# EAGLE schematic ORing_block (EAGLE 8.1.0)
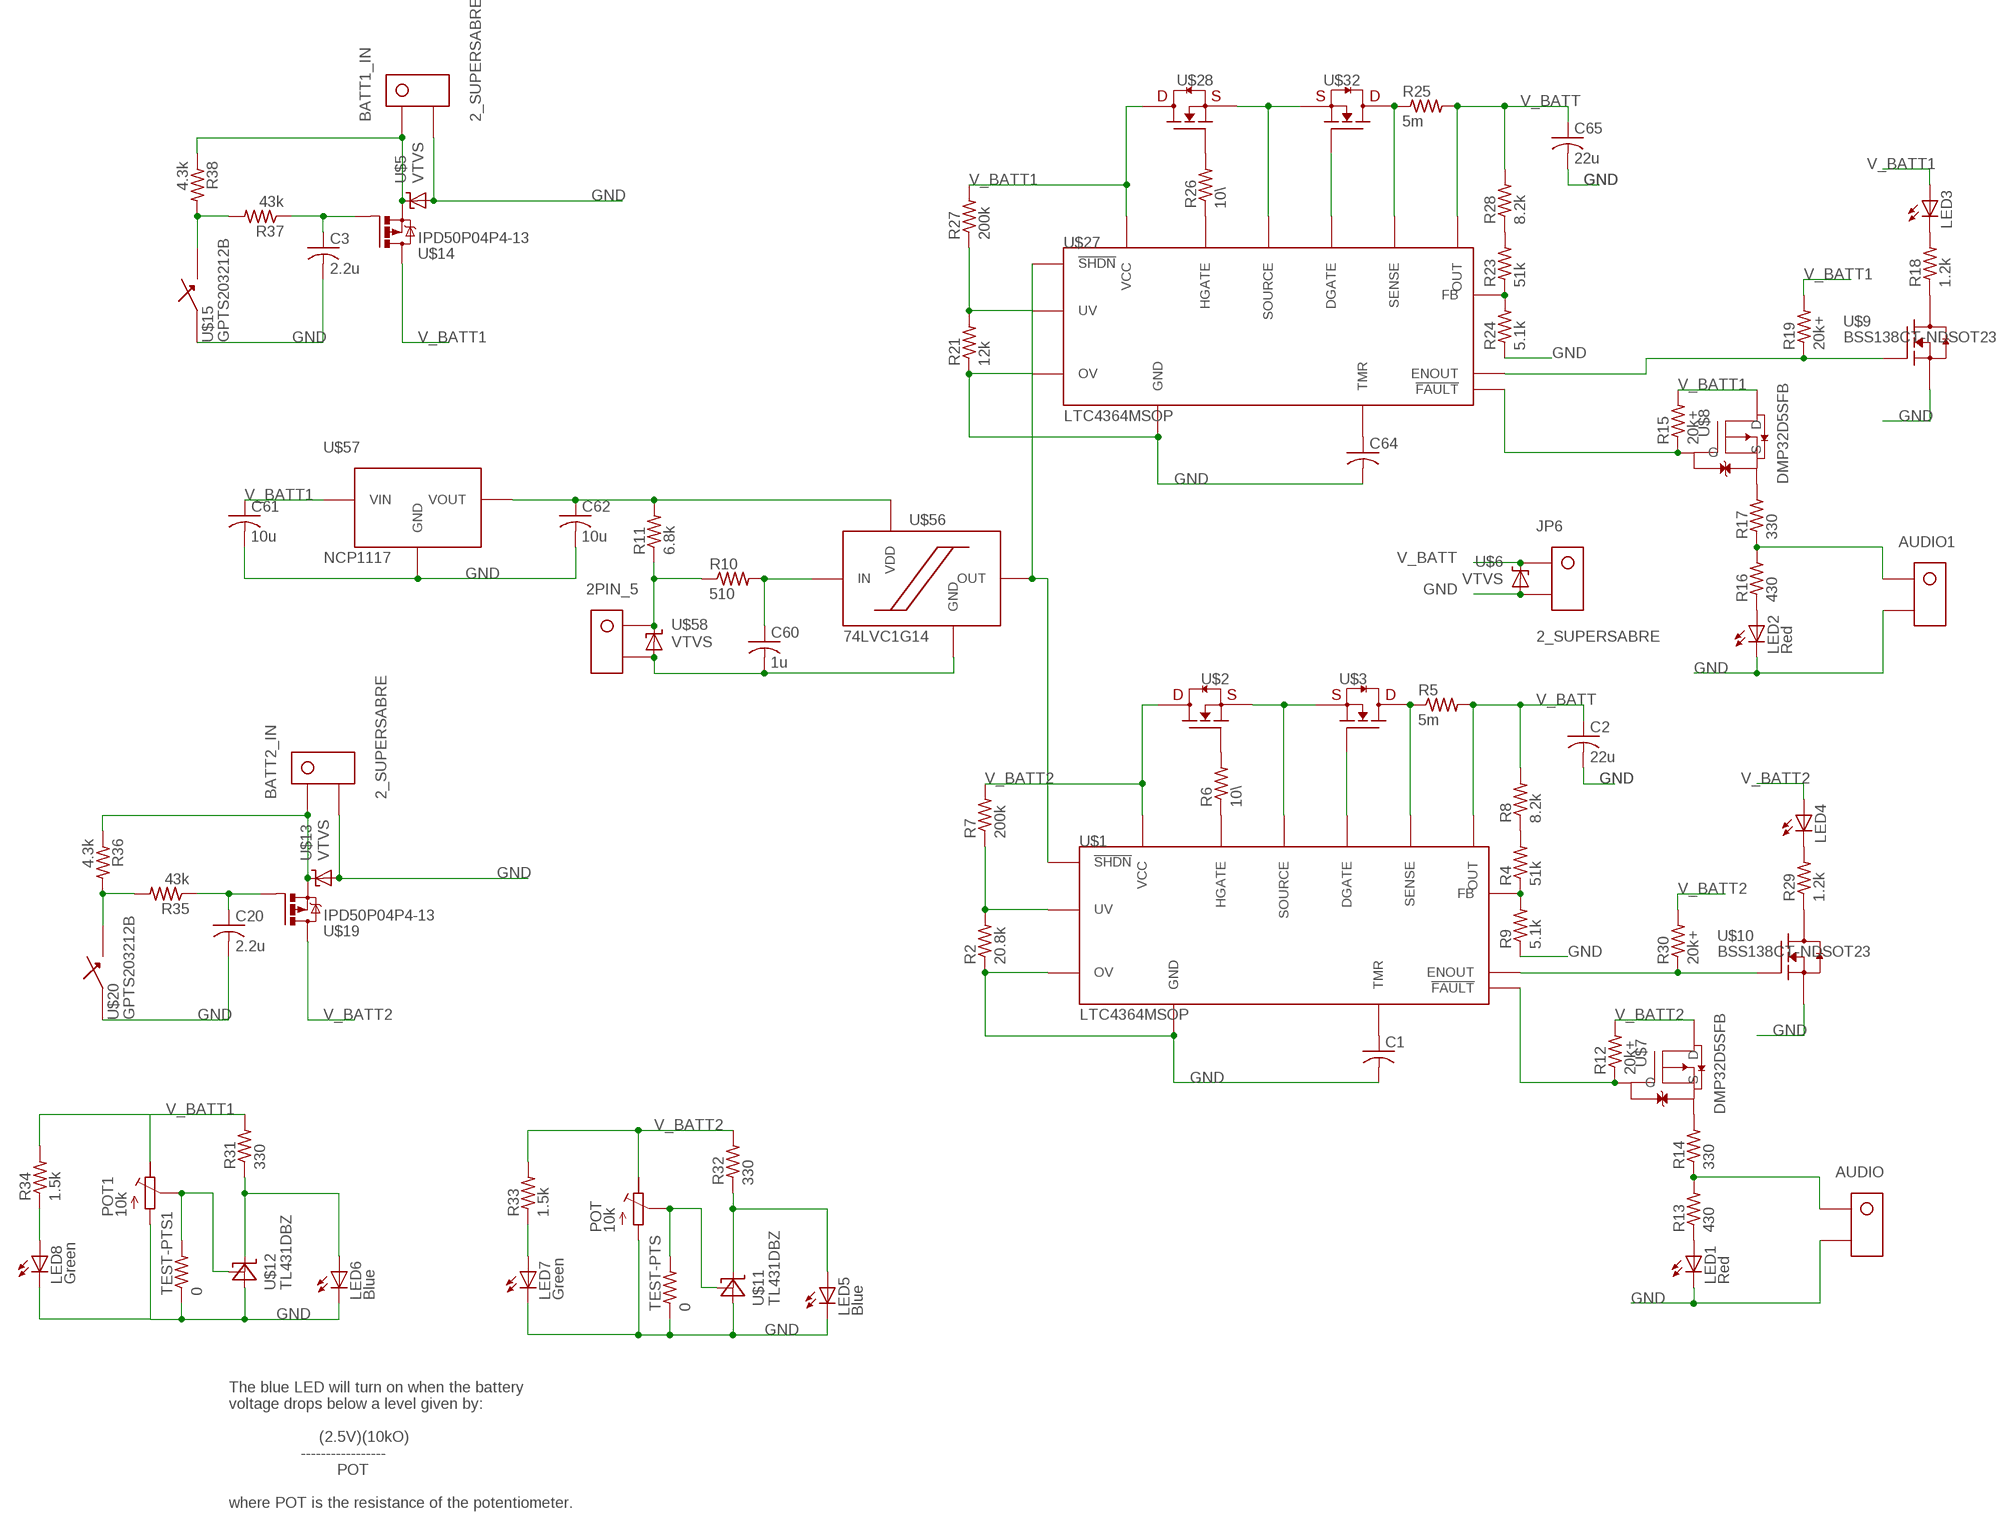
[diagram p0: schematic, sheet 1]

## Parts
2PIN_5  KK254_VERT_2PIN22-29-2021  [KK254_VERT_2PIN]
AUDIO  KK254_VERT_2PIN22-29-2021  [KK254_VERT_2PIN]
AUDIO1  KK254_VERT_2PIN22-29-2021  [KK254_VERT_2PIN]
BATT1_IN  2_SUPERSABRE  [SUPERSABRE_2CIRCUIT]
BATT2_IN  2_SUPERSABRE  [SUPERSABRE_2CIRCUIT]
C1  C-USC0805  [C0805]
C2  22u  C-USC0805  [C0805]
C3  2.2u  C-USC0805  [C0805]
C20  2.2u  C-USC0805  [C0805]
C60  1u  C-USC0805  [C0805]
C61  10u  C-USC0805  [C0805]
C62  10u  C-USC0805  [C0805]
C64  C-USC0805  [C0805]
C65  22u  C-USC0805  [C0805]
JP6  2_SUPERSABRE  [SUPERSABRE_2CIRCUIT]
LED1  Red  LEDCHIPLED_0805  [CHIPLED_0805]
LED2  Red  LEDCHIPLED_0805  [CHIPLED_0805]
LED3  LEDCHIPLED_0805  [CHIPLED_0805]
LED4  LEDCHIPLED_0805  [CHIPLED_0805]
LED5  Blue  0805_LED  [0805]
LED6  Blue  0805_LED  [0805]
LED7  Green  0805_LED  [0805]
LED8  Green  0805_LED  [0805]
POT  10k  R-TRIMMPTV09A-4  [PTV09A-4]
POT1  10k  R-TRIMMPTV09A-4  [PTV09A-4]
R2  20.8k  R-US_R0805  [R0805]
R4  51k  R-US_R0805  [R0805]
R5  5m  R-US_R0805  [R0805]
R6  10\  R-US_R0805  [R0805]
R7  200k  R-US_R0805  [R0805]
R8  8.2k  R-US_R0805  [R0805]
R9  5.1k  R-US_R0805  [R0805]
R10  510  R-US_R0805  [R0805]
R11  6.8k  R-US_R0805  [R0805]
R12  20k+  R-US_R0805  [R0805]
R13  430  R-US_R0805  [R0805]
R14  330  R-US_R0805  [R0805]
R15  20k+  R-US_R0805  [R0805]
R16  430  R-US_R0805  [R0805]
R17  330  R-US_R0805  [R0805]
R18  1.2k  R-US_R0805  [R0805]
R19  20k+  R-US_R0805  [R0805]
R21  12k  R-US_R0805  [R0805]
R23  51k  R-US_R0805  [R0805]
R24  5.1k  R-US_R0805  [R0805]
R25  5m  R-US_R0805  [R0805]
R26  10\  R-US_R0805  [R0805]
R27  200k  R-US_R0805  [R0805]
R28  8.2k  R-US_R0805  [R0805]
R29  1.2k  R-US_R0805  [R0805]
R30  20k+  R-US_R0805  [R0805]
R31  330  R-US_R0805  [R0805]
R32  330  R-US_R0805  [R0805]
R33  1.5k  R-US_R0805  [R0805]
R34  1.5k  R-US_R0805  [R0805]
R35  43k  R-US_R0805  [R0805]
R36  4.3k  R-US_R0805  [R0805]
R37  43k  R-US_R0805  [R0805]
R38  4.3k  R-US_R0805  [R0805]
TEST-PTS  0  R-US_V526-0  [V526-0]
TEST-PTS1  0  R-US_V526-0  [V526-0]
U$1  LTC4364MSOP  [MSOP16]
U$2  FDMC8360LET40PWR33  [POWER33]
U$3  FDMC8360LET40PWR33  [POWER33]
U$5  VTVS  [DO-219AB]
U$6  VTVS  [DO-219AB]
U$7  DMP32D5SFB  [AP02002]
U$8  DMP32D5SFB  [AP02002]
U$9  BSS138CT-NDSOT23  [SOT23]
U$10  BSS138CT-NDSOT23  [SOT23]
U$11  TL431DBZ  [SOT-23-3]
U$12  TL431DBZ  [SOT-23-3]
U$13  VTVS  [DO-219AB]
U$14  IPD50P04P4-13  [TO252-3]
U$15  GPTS203212B  [GPTS203211B]
U$19  IPD50P04P4-13  [TO252-3]
U$20  GPTS203212B  [GPTS203211B]
U$27  LTC4364MSOP  [MSOP16]
U$28  FDMC8360LET40PWR33  [POWER33]
U$32  FDMC8360LET40PWR33  [POWER33]
U$56  74LVC1G14  [TSSOP5]
U$57  NCP1117  [SOT-223]
U$58  VTVS  [DO-219AB]

## Nets
GND: AUDIO1.P$2 AUDIO.P$2 BATT1_IN.P$2 BATT2_IN.P$2 C1.2 C2.2 C3.2 C20.2 C61.2 C62.2 C64.2 C65.2 JP6.P$2 LED1.C LED2.C LED5.P$2(C) LED6.P$2(C) LED7.P$2(C) LED8.P$2(C) POT1.P$3(E) POT.P$3(E) R2.1 R9.1 R21.1 R24.1 TEST-PTS1.1 TEST-PTS.1 U$1.GND U$1.OV U$5.P$1(A) U$6.P$1(A) U$9.2(S) U$10.2(S) U$11.P$3(A) U$12.P$3(A) U$13.P$1(A) U$15.P$1 U$20.P$1 U$27.GND U$27.OV U$57.P$1(GND)
N$1: R2.2 R7.1 U$1.UV
N$3: R4.1 R9.2 U$1.FB
N$4: R6.1 U$1.HGATE
N$6: C1.1 U$1.TMR
N$7: R4.2 R8.1
N$8: R6.2 U$2.GATE
N$9: U$1.SOURCE U$2.SOURCE1(SOURCE) U$2.SOURCE2(SOURCE) U$2.SOURCE3(SOURCE) U$3.SOURCE1(SOURCE) U$3.SOURCE2(SOURCE) U$3.SOURCE3(SOURCE)
N$10: R5.1 U$1.SENSE U$3.DRAIN
N$11: U$1.DGATE U$3.GATE
N$12: 2PIN_5.P$1 R10.1 R11.1 U$58.P$2(C)
N$13: C62.1 R11.2 U$56.P$5(VDD) U$57.P$2(VOUT) U$57.P$4(VOUT)
N$14: U$1.SHDN(!SHDN!) U$27.SHDN(!SHDN!) U$56.P$4(OUT)
N$15: R14.2 U$7.P$1(S)
N$16: LED1.A R13.1
N$17: R12.1 U$1.FLT(!FAULT!) U$7.P$2(G)
N$18: AUDIO.P$1 R13.2 R14.1
N$19: LED2.A R16.1
N$20: R15.1 U$8.P$2(G) U$27.FLT(!FAULT!)
N$21: R17.2 U$8.P$1(S)
N$22: AUDIO1.P$1 R16.2 R17.1
N$23: POT.P$2(S) TEST-PTS.2 U$11.P$2(REF)
N$24: R18.1 U$9.3(D)
N$25: LED3.C R18.2
N$26: R29.1 U$10.3(D)
N$27: LED4.C R29.2
N$28: R30.1 U$1.ENOUT U$10.1(G)
N$29: R19.1 U$9.1(G) U$27.ENOUT
N$30: LED5.P$1(A) R32.1 U$11.P$1(C)
N$31: POT1.P$2(S) TEST-PTS1.2 U$12.P$2(REF)
N$32: LED6.P$1(A) R31.1 U$12.P$1(C)
N$33: LED7.P$1(A) R33.1
N$34: LED8.P$1(A) R34.1
N$35: C20.1 R35.1 U$19.1(G)
N$36: R35.2 R36.2 U$20.P$2
N$37: R26.1 U$27.HGATE
N$38: BATT1_IN.P$1 R38.1 U$5.P$2(C) U$14.TAB(D)
N$39: R21.2 R27.1 U$27.UV
N$40: C3.1 R37.1 U$14.1(G)
N$41: R37.2 R38.2 U$15.P$2
N$45: BATT2_IN.P$1 R36.1 U$13.P$2(C) U$19.TAB(D)
N$48: 2PIN_5.P$2 C60.2 U$56.P$3(GND) U$58.P$1(A)
N$49: C60.1 R10.2 U$56.P$2(IN)
N$50: R23.1 R24.2 U$27.FB
N$53: C64.1 U$27.TMR
N$54: U$27.SOURCE U$28.SOURCE1(SOURCE) U$28.SOURCE2(SOURCE) U$28.SOURCE3(SOURCE) U$32.SOURCE1(SOURCE) U$32.SOURCE2(SOURCE) U$32.SOURCE3(SOURCE)
N$57: R23.2 R28.1
N$59: R26.2 U$28.GATE
N$60: R25.1 U$27.SENSE U$32.DRAIN
N$61: U$27.DGATE U$32.GATE
V_BATT: C2.1 C65.1 JP6.P$1 R5.2 R8.2 R25.2 R28.2 U$1.OUT U$6.P$2(C) U$27.OUT
V_BATT1: C61.1 LED3.A POT1.P$1(A) R15.2 R19.2 R27.2 R31.2 R34.2 U$8.P$3(D) U$14.3(S) U$27.VCC U$28.DRAIN U$57.P$3(VIN)
V_BATT2: LED4.A POT.P$1(A) R7.2 R12.2 R30.2 R32.2 R33.2 U$1.VCC U$2.DRAIN U$7.P$3(D) U$19.3(S)

## Notes on the sheet
- The blue LED will turn on when the battery
  voltage drops below a level given by:
  
                      (2.5V)(10kO)
                  -----------------
                          POT
  
  where POT is the resistance of the potentiometer.

## Library data of the parts
2PIN_5 AUDIO AUDIO1 = molex:KK254_VERT_2PIN: KK® 254 Wire-to-Board Header, Vertical, with Friction Lock, 2 Circuits, Gold (Au) Plating Part Number: 22-29-2021 http://www.molex.com/molex/products/datasheet.jsp?part=active/0022292021_PCB_HEADERS.xml
BATT1_IN BATT2_IN JP6 = molex:2_SUPERSABRE: Molex SuperSabre 2-pin vertical header
C1-C3 C20 C60-C62 C64 C65 = resistor:C-US: CAPACITOR, American symbol
LED1-LED4 = led:LED: LED OSRAM: - CHIPLED LG R971, LG N971, LY N971, LG Q971, LY Q971, LO R971, LY R971 LH N974, LH R974 LS Q976, LO Q976, LY Q976 LO Q996 - Hyper CHIPLED LW Q18S LB Q993, LB Q99A, LB R99A - SideLED LS A670, LO A670, LY A670, LG A670, LP A670 LB A673, LV A673, LT A673, LW A673 LH A674 LY A675 LS A676, LA A676, LO A676, LY A676, LW A676 LS A679, LY A679, LG A679 - Hyper Micro SIDELED® LS Y876, LA Y876, LO Y876, LY Y876 LT Y87S - SmartLED LW L88C, LW L88S LB L89C, LB L89S, LG L890 LS L89K, LO L89K, LY L89K LS L896, LA L896, LO L896, LY L896 - TOPLED LS T670, LO T670, LY T670, LG T670, LP T670 LSG T670, LSP T670, LSY T670, LOP T670, LYG T670 LG T671, LOG T671, LSG T671 LB T673, LV T673, LT T673, LW T673 LH T674 LS T676, LA T676, LO T676, LY T676, LB T676, LH T676, LSB T676, LW T676 LB T67C, LV T67C, LT T67C, LS T67K, LO T67K, LY T67K, LW E67C LS E67B, LA E67B, LO E67B, LY E67B, LB E67C, LV E67C, LT E67C LW T67C LS T679, LY T679, LG T679 LS T770, LO T770, LY T770, LG T770, LP T770 LB T773, LV T773, LT T773, LW T773 LH T774 LS E675, LA E675, LY E675, LS T675 LS T776, LA T776, LO T776, LY T776, LB T776 LHGB T686 LT T68C, LB T68C - Hyper Mini TOPLED® LB M676 - Mini TOPLED Santana® LG M470 LS M47K, LO M47K, LY M47K Source: http://www.osram.convergy.de LUXEON: - LUMILED® LXK2-PW12-R00, LXK2-PW12-S00, LXK2-PW14-U00, LXK2-PW14-V00 LXK2-PM12-R00, LXK2-PM12-S00, LXK2-PM14-U00 LXK2-PE12-Q00, LXK2-PE12-R00, LXK2-PE12-S00, LXK2-PE14-T00, LXK2-PE14-U00 LXK2-PB12-K00, LXK2-PB12-L00, LXK2-PB12-M00, LXK2-PB14-N00, LXK2-PB14-P00, LXK2-PB14-Q00 LXK2-PR12-L00, LXK2-PR12-M00, LXK2-PR14-Q00, LXK2-PR14-R00 LXK2-PD12-Q00, LXK2-PD12-R00, LXK2-PD12-S00 LXK2-PH12-R00, LXK2-PH12-S00 LXK2-PL12-P00, LXK2-PL12-Q00, LXK2-PL12-R00 Source: www.luxeon.com KINGBRIGHT: KA-3528ASYC Source: www.kingbright.com
LED5-LED8 = led:0805_LED: LED, 0805 package. Any variety.
POT POT1 = resistor:R-TRIMM: Trimm resistor
R2 R4-R19 R21 R23-R38 TEST-PTS TEST-PTS1 = resistor:R-US_: RESISTOR, American symbol
U$1 U$27 = linear:LTC4364
U$2 U$3 U$28 U$32 = fairchild:FDMC8360LET40
U$5 U$6 U$13 U$58 = diode:VTVS: Vishay VTVS5V0ASMF to VTVS63GSMF 400W TVS diodes Datasheet <http://www.mouser.com/ds/2/427/vtvs5v0asmf-1078013.pdf>
U$7 U$8 = transistor-fet:DMP32D5SFB: Diodes Inc. DMP32D5SFB 30V P-MOSFET (Enhancement) Datasheet <http://www.mouser.com/ds/2/115/DMP32D5SFB-765036.pdf>
U$9 U$10 = transistor-fet:BSS138CT-ND: ON Semiconductor BSS138 N-MOSFET, Logic Level Datasheet <http://www.mouser.com/ds/2/149/BSS138-1006682.pdf>
U$11 U$12 = texas:TL431: Texas Instruments TL431 Adjustable shunt regulator Datasheet <http://www.ti.com/lit/ds/symlink/tl431.pdf>
U$14 U$19 = transistor-power:IPD50P04P4-13: Infineon IPD50P04P4-13 OptiMOS®-P2 Power-Transistor Datasheet <http://www.mouser.com/ds/2/196/Infineon-IPD50P04P4-13-DS-v01_02-EN-336147.pdf>
U$15 U$20 = switches:GPTS203212B: CW Industries Pushbutton SPST switch ON-OFF, 1A, 30VDC Datasheet <http://switches-connectors-custom.cwind.com/Asset/GPTS203211BR2.pdf>
U$56 = NXP:74LVC1G14: Nexperia 74LVC1G14 Single Schmitt trigger inverter Datasheet <http://www.mouser.com/ds/2/302/74LVC1G14_Q100-839654.pdf>
U$57 = ONSemi:NCP1117: ON Semiconductor NCP1117 5V 1A Fixed LDO Datasheet <http://www.mouser.com/ds/2/308/NCP1117-D-81326.pdf>